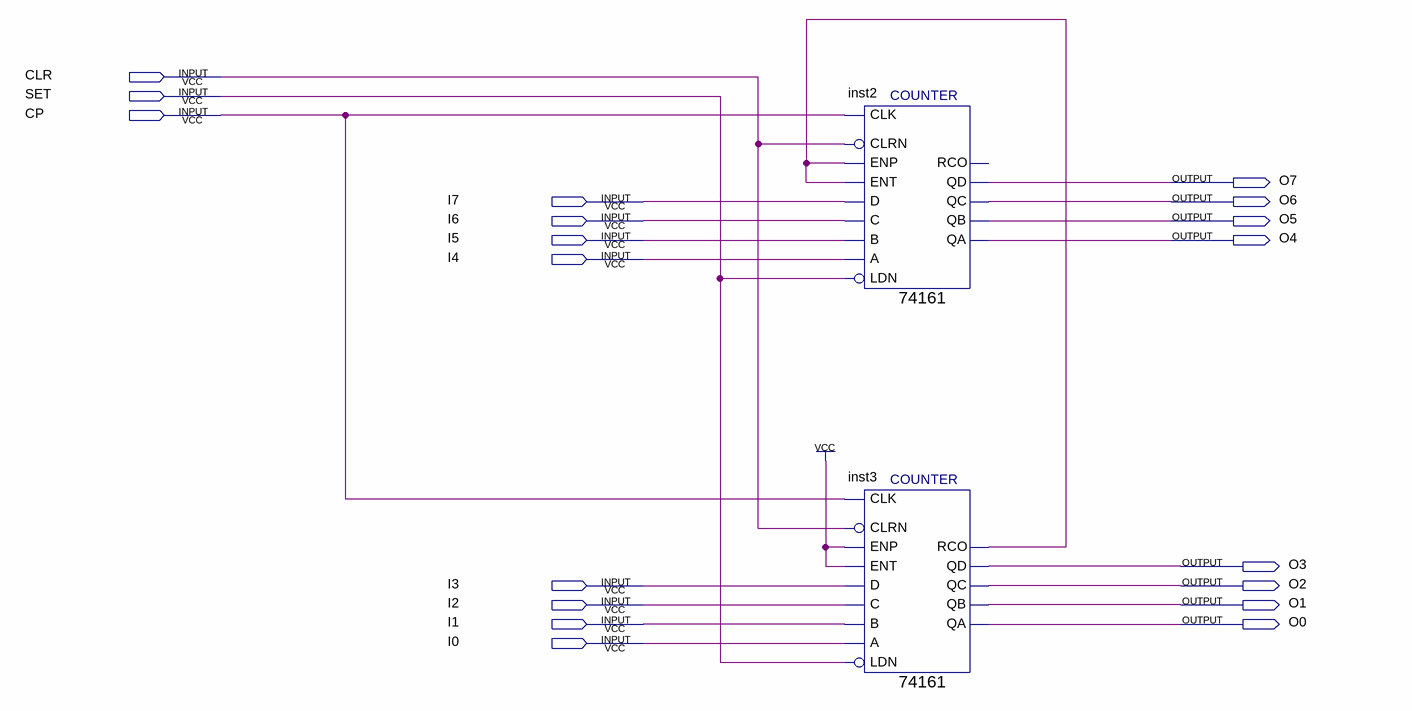
[diagram p0: schematic sheet]
// Quartus schematic counter_with_set_8_advanced.bdf as structural Verilog: 2 symbols, 19 pins
module counter_with_set_8_advanced (
  input  CLR,
  input  SET,
  input  CP,
  input  I7,
  input  I6,
  input  I5,
  input  I4,
  input  I3,
  input  I2,
  input  I1,
  input  I0,
  output O7,
  output O6,
  output O5,
  output O4,
  output O3,
  output O2,
  output O1,
  output O0
);

  wire inst3_rco;

  \74161  inst2 (
    .CLRN(CLR), .CLK(CP), .ENP(inst3_rco), .LDN(SET), .A(I4), .D(I7), .ENT(inst3_rco), .B(I5), .C(I6),
    .QD(O7), .QC(O6), .QB(O5), .QA(O4));  // open: RCO
  \74161  inst3 (
    .CLRN(CLR), .CLK(CP), .ENP(1'b1), .LDN(SET), .A(I0), .D(I3), .ENT(1'b1), .B(I1), .C(I2), .QD(O3),
    .QC(O2), .QB(O1), .QA(O0), .RCO(inst3_rco));
endmodule
